# EAGLE schematic scoreboard (EAGLE 8.1.0)
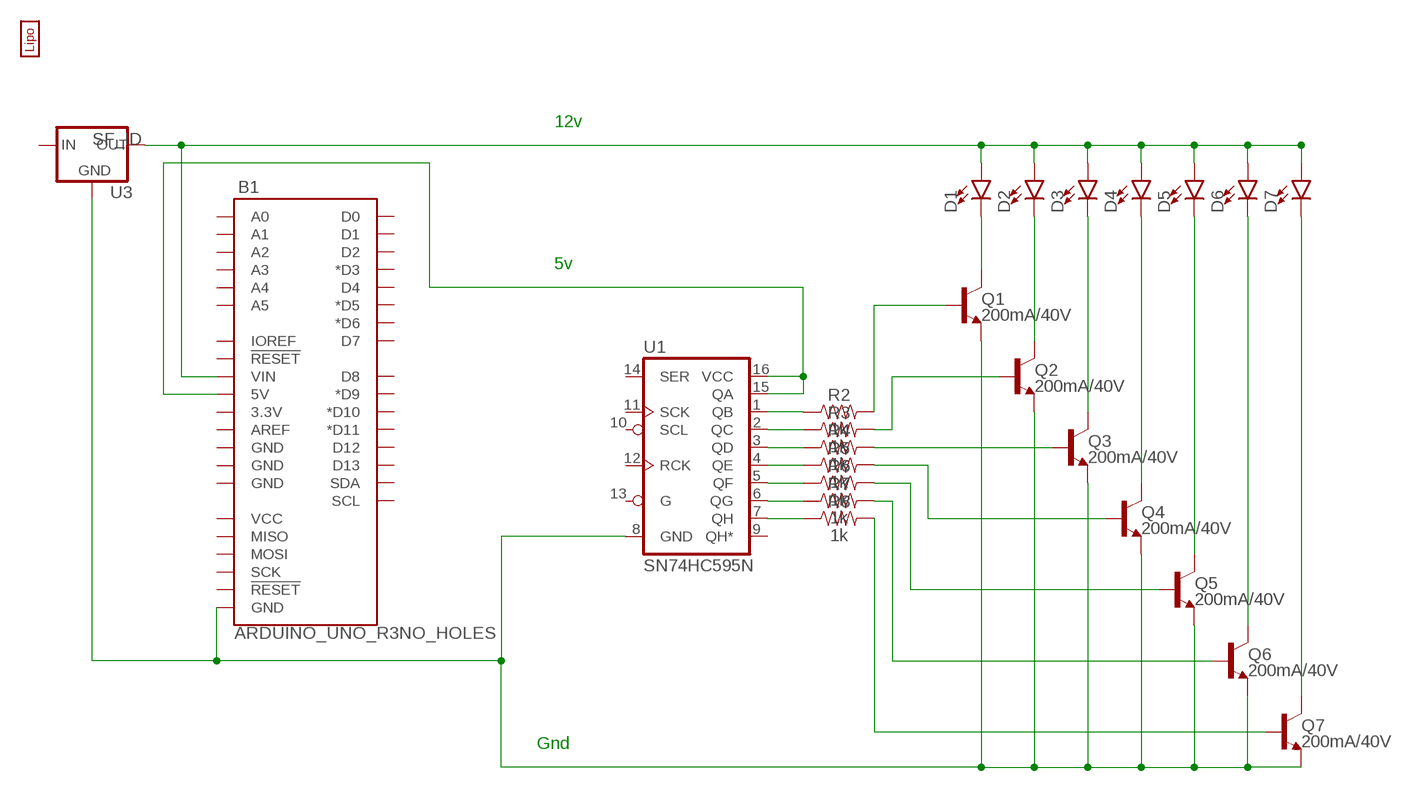
[diagram p0: schematic, sheet 1]

## Parts
B1  ARDUINO_UNO_R3NO_HOLES  [ARDUINO_R3_NO_HOLES]
BT1  LIPO-OUTLINE2000  [LIPO-2000]
D1  LED3MM  [LED_3MM]
D2  LED3MM  [LED_3MM]
D3  LED3MM  [LED_3MM]
D4  LED3MM  [LED_3MM]
D5  LED3MM  [LED_3MM]
D6  LED3MM  [LED_3MM]
D7  LED3MM  [LED_3MM]
Q1  200mA/40V  TRANS_NPN-2N3904  [TO-92]
Q2  200mA/40V  TRANS_NPN-2N3904  [TO-92]
Q3  200mA/40V  TRANS_NPN-2N3904  [TO-92]
Q4  200mA/40V  TRANS_NPN-2N3904  [TO-92]
Q5  200mA/40V  TRANS_NPN-2N3904  [TO-92]
Q6  200mA/40V  TRANS_NPN-2N3904  [TO-92]
Q7  200mA/40V  TRANS_NPN-2N3904  [TO-92]
R2  1k  1KOHM-HORIZ-1/4W-5%  [AXIAL-0.3]
R3  1k  1KOHM-HORIZ-1/4W-5%  [AXIAL-0.3]
R4  1k  1KOHM-HORIZ-1/4W-5%  [AXIAL-0.3]
R5  1k  1KOHM-HORIZ-1/4W-5%  [AXIAL-0.3]
R6  1k  1KOHM-HORIZ-1/4W-5%  [AXIAL-0.3]
R7  1k  1KOHM-HORIZ-1/4W-5%  [AXIAL-0.3]
R8  1k  1KOHM-HORIZ-1/4W-5%  [AXIAL-0.3]
U1  SN74HC595N  74HC595N  [DIP16]
U3  V_REG_78XX-TO-220  [TO-220-ALT]

## Nets
N$1: R2.P$1 U1.1(QB)
N$2: R3.P$1 U1.2(QC)
N$3: R4.P$1 U1.3(QD)
N$4: R5.P$1 U1.4(QE)
N$5: R6.P$1 U1.5(QF)
N$6: R7.P$1 U1.6(QG)
N$7: R8.P$1 U1.7(QH)
N$8: B1.5V U1.16(VCC)
N$9: B1.GND@1(GND) Q1.1(E) Q2.1(E) Q3.1(E) Q4.1(E) Q5.1(E) Q6.1(E) Q7.1(E) U1.8(GND) U3.GND
N$10: Q1.2(B) R2.P$2
N$11: Q2.2(B) R3.P$2
N$12: Q3.2(B) R4.P$2
N$13: Q4.2(B) R5.P$2
N$14: Q5.2(B) R6.P$2
N$15: Q6.2(B) R7.P$2
N$16: Q7.2(B) R8.P$2
N$17: D1.A D2.A D3.A D4.A D5.A D6.A D7.A U3.OUT
N$18: D1.K(C) Q1.3(C)
N$19: D2.K(C)
N$20: D3.K(C) Q3.3(C)
N$21: D4.K(C) Q4.3(C)
N$22: D5.K(C) Q5.3(C)
N$23: D6.K(C) Q6.3(C)
N$24: D7.K(C) Q7.3(C)
Unconnected: B1.3.3V B1.A0 B1.A1 B1.A2 B1.A3 B1.A4 B1.A5 B1.AREF B1.D0 B1.D1 B1.D2 B1.D3(*D3) B1.D4 B1.D5(*D5) B1.D6(*D6) B1.D7 B1.D8 B1.D9(*D9) B1.D10(*D10) B1.D11(*D11) B1.D12 B1.D13 B1.GND@2(GND) B1.GND@3(GND) B1.GND@4(GND) B1.IOREF B1.MISO B1.MOSI B1.RESET@1(!RESET!) B1.RESET@2(!RESET!) B1.SCK B1.SCL B1.SDA B1.VCC B1.VIN Q2.3(C) U1.9(QH*) U1.10(SCL) U1.11(SCK) U1.12(RCK) U1.13(G) U1.14(SER) U1.15(QA) U3.IN

## Notes on the sheet
- 12v
- 5v
- Gnd

## Library data of the parts
B1 = SparkFun-Boards:ARDUINO_UNO_R3: Arduino R3 Footprint with SPI header Arduino Uno R3 Compatible Footprint. Matches PCB size of the original board. SparkFun Products: SAMD21 Dev Breakout <https://www.sparkfun.com/products/13672> RedBoard <https://www.sparkfun.com/products/12757> R3 Stackable Headers <https://www.sparkfun.com/products/11417>
BT1 = SparkFun-Batteries:LIPO-OUTLINE: LiPo Battery Outlines Outlines for common LiPo batteries sold by SparkFun. (Note: no terminals or connection points, just the dimensions.) SparkFun Products Polymer Lithium Ion Battery - 110mAh <https://www.sparkfun.com/products/13853> (PRT-13853) Polymer Lithium Ion Battery - 1000mAh <https://www.sparkfun.com/products/13813> (PRT-13813) Polymer Lithium Ion Battery - 2000mAh <https://www.sparkfun.com/products/8483> (PRT-08483); PROD_ID: BATT-08764; SF_SKU: PRT-08483
D1-D7 = SparkFun-LED:LED: LED (Generic) Standard schematic elements and footprints for 5mm, 3mm, 1206, and 0603 sized LEDs. Generic LEDs with no color specified.; PROD_ID: DIO-08794
Q1-Q7 = SparkFun-DiscreteSemi:TRANS_NPN: NPN transistor Current controlled devices typically used to amplify current or used as a switch. BC547 - COM-08928 <http://www.sparkfun.com/products/8928> (TO-92 45V 100mA) (1.Collector 2.Base 3.Emitter) 2N3904 - COM-00521 <http://www.sparkfun.com/products/521> (TO-92 40V 200mA) (1.Emitter 2.Base 3.Collector) P2N2222A - COM-12852 <http://www.sparkfun.com/products/12852> (TO-92 40V 600mA) (1.Collector 2.Base 3.Emitter); PROD_ID: TRANS-08447
R2-R8 = SparkFun-Resistors:1KOHM: 1kΩ resistor A resistor is a passive two-terminal electrical component that implements electrical resistance as a circuit element. Resistors act to reduce current flow, and, at the same time, act to lower voltage levels within circuits. - Wikipedia; PROD_ID: RES-08380
U1 = SparkFun-IC-Logic:74*595: 8-Bit Shift Register (Serial to Parallel) Datasheet <http://cdn.sparkfun.com/datasheets/BreakoutBoards/MM74HC595.pdf> SparkFun Products SparkFun Shift Register Breakout - 74HC595 <https://www.sparkfun.com/products/10680> (BOB-10680); PROD_ID: IC-13123
U3 = SparkFun-IC-Power:V_REG_78XX: Voltage Regulator Standard 78xx regulator. IGO (Input Ground Output). Spark Fun Electronics SKU : COM-00107; PROD_ID: VREG-08450; SF_ID: COM-00107